# Altium schematic sheet some_mini_things.SchDoc
size A4
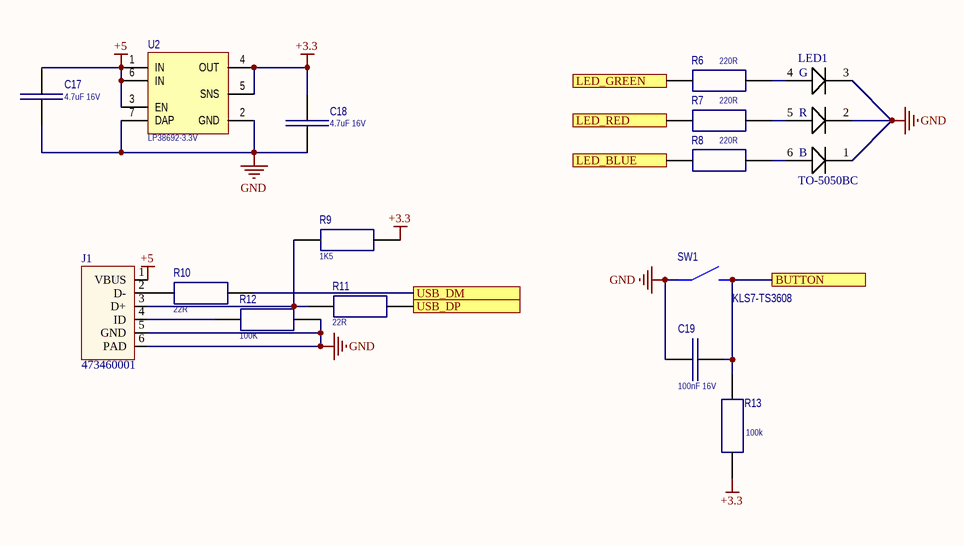
[diagram p0: some_mini_things.SchDoc]

## Parts
C17  4.7uF 16V  [C_0805]
C18  4.7uF 16V  [C_0805]
C19  100nF 16V  [C_0805]
J1  473460001  [micro-USB]
LED1  TO-5050BC  [TO-5050BC]
R6  220R  [R_0805]
R7  220R  [R_0805]
R8  220R  [R_0805]
R9  1K5  [R_0805]
R10  22R  [R_0805]
R11  22R  [R_0805]
R12  100K  [R_0805]
R13  100k  [R_0805]
SW1  KLS7-TS3608  [KLS7-TS3611]
U2  LP38692-3.3V  [WSON-6]

## Ports
BUTTON, LED_BLUE, LED_GREEN, LED_RED, USB_DM, USB_DP

## Nets
+3.3: C18.2 R9.2 R13.1 U2.4(OUT) U2.5(SNS)
+5: C17.2 J1.1(VBUS) U2.1(IN) U2.3(EN) U2.6(IN)
GND: C17.1 C18.1 C19.2 J1.5(GND) J1.6(PAD) LED1.1 LED1.2 LED1.3 R12.2 SW1.1 U2.2(GND) U2.7(DAP)
BUTTON: C19.1 R13.2 SW1.2 ; port BUTTON
LED_BLUE: R8.1 ; port LED_BLUE
LED_GREEN: R6.1 ; port LED_GREEN
LED_RED: R7.1 ; port LED_RED
USB_DM: R10.2 ; port USB_DM
USB_DP: R11.2 ; port USB_DP
NetJ1_2: J1.2(D-) R10.1
NetJ1_3: J1.3(D+) R9.1 R11.1
NetJ1_4: J1.4(ID) R12.1
NetLED1_4: LED1.4 R6.2
NetLED1_5: LED1.5 R7.2
NetLED1_6: LED1.6 R8.2

## Notes on the sheet
- (in symbol TO-5050BC) G; R; B

## Library data of the parts
C17-C19 = C0805: Capacitor
  C17 C18: Value: 4.7uF 16V
  C19: Value: 100nF 16V
J1 = MICRO-USB: molex 473460001
LED1 = TO-5050BC: RGB led
R6-R13 = R0805: Resistor
  R6-R8: Value: 220R
  R9: Value: 1K5
  R10 R11: Value: 22R
  R12: Value: 100K
  R13: Value: 100k
SW1 = button
U2 = LP38692: LP38690, LP38692 1-A LDO CMOS Linear Regulators  Stable with Ceramic Output Capacitors